# EAGLE design Dolgin_ATTinyV7 (EAGLE 9.4.2)
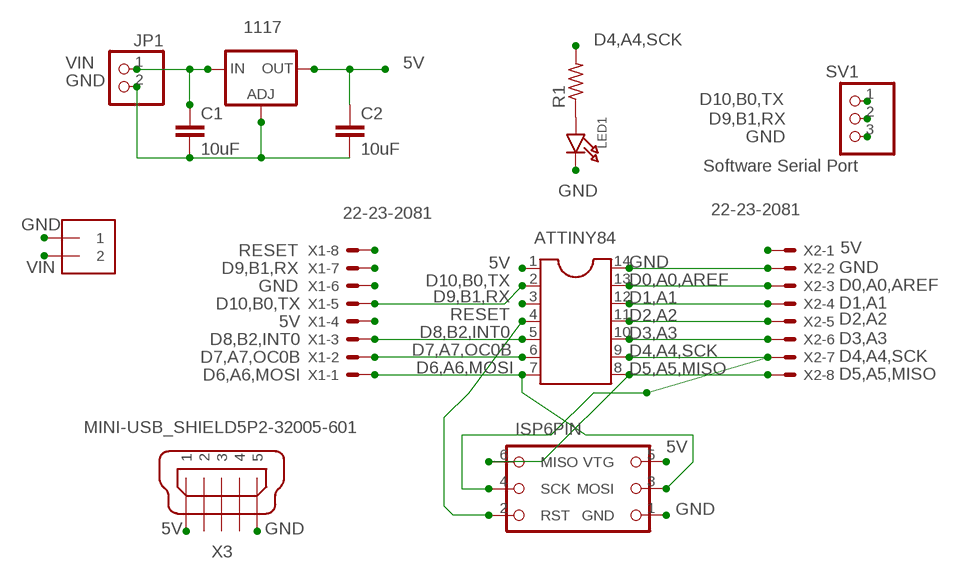
[diagram p0: schematic, sheet 1]

## Parts
1117  LM1117SOT223-REFLOW  [SOT223-R]
ATTINY84  DIL14  [DIL14]
C1  10uF  10UF-1206-6.3V-20%  [1206]
C2  10uF  10UF-1206-6.3V-20%  [1206]
H1  ISP_HEADER  [ICSP]
J1  1X2-3.5MM  [1X2-3.5MM]
JP1  PINHD-1X2  [1X02]
LED1  LED1206  [CHIPLED_1206]
R1  R-US_R1206  [R1206]
SV1  Software Serial Port  PINHD-1X3/90  [1X03/90]
X1  22-23-2081  [22-23-2081]
X2  22-23-2081  [22-23-2081]
X3  MINI-USB_SHIELD5P2-32005-601  [32005-601]

## Nets
5V: 1117.2(OUT) ATTINY84.1 C2.1 H1.5(VTG) X1.4 X2.1 X3.1
D0,A0,AREF: ATTINY84.13 X2.3
D1,A1: ATTINY84.12 X2.4
D2,A2: ATTINY84.11 X2.5
D3,A3: ATTINY84.10 X2.6
D4,A4,SCK: ATTINY84.9 H1.4(SCK) R1.2 X2.7
D5,A5,MISO: ATTINY84.8 H1.6(MISO) X2.8
D6,A6,MOSI: ATTINY84.7 H1.3(MOSI) X1.1
D7,A7,OC0B: ATTINY84.6 X1.2
D8,B2,INT0: ATTINY84.5 X1.3
D9,B1,RX: ATTINY84.3 SV1.2 X1.7
D10,B0,TX: ATTINY84.2 SV1.3 X1.5
GND: 1117.1(ADJ) ATTINY84.14 C1.2 C2.2 H1.1(GND) J1.1 JP1.2 LED1.C SV1.1 X1.6 X2.2 X3.5
N$1: LED1.A R1.1
RESET: ATTINY84.4 H1.2(RST) X1.8
VIN: 1117.3(IN) C1.1 J1.2 JP1.1
Unconnected: X3.2 X3.3 X3.4 X3.M1(S1) X3.M2(S2)

## Library data of the parts
1117 = microbuilder:LM1117: LM1117 Voltage Regulator LM1117 Adjustable Voltage regulator [Digikey: LM1117IMP-ADJDKR-ND] LM1117 3.3V Voltage regulator [AP1117E33GDIDKR-ND] LM1117 5.0V Voltage regulator [AP1117E50GDIDKR-ND] SOT223-REFLOW - SOT223 package for solder paste/reflow ovens SOT223-WAVE - SOT223 package for hand-soldering (larger pads) Note: For the fixed-voltage regulators, simply set the ADJ pin to GND.
ATTINY84 = ic-package:DIL14: Dual In Line / Socket
C1 C2 = SparkFun-Capacitors:10UF: 10.0µF ceramic capacitors A capacitor is a passive two-terminal electrical component used to store electrical energy temporarily in an electric field.; PROD_ID: CAP-10057
H1 = ACES_THT:ISP_HEADER: No more excuses for getting these lines crossed!
J1 = adafruit:1X2: 3.5mm Terminal block http://www.ladyada.net/library/pcb/eaglelibrary.html
JP1 = pinhead:PINHD-1X2: PIN HEADER
LED1 = microbuilder:LED: LED 0603 - 0603 Surface Mount Package 2mA: Green LED - Low Power (3.9mcd, 2ma, 1.7Vf) - Digikey: 475-2709-2-ND Orange LED - Low Power (9.8mcd, 2ma, 1.8Vf) - Digikey: 475-1194-2-ND Red LED - Low Power (5mcd, 2ma, 1.8Vf) - Digikey: 475-1195-2-ND Yellow LED - Low Power (7mcd, 2ma, 1.8Vf) - Digikey: 475-1196-2-ND 5mA: Blue LED - Low Power (17mcd, 5ma, 2.9Vf) - Digikey: LNJ937W8CRACT-ND 0805 - 0805 Surface Mount Package 2mA: Red LED (8.8mcd, 2mA, 1.8Vf, Clear) - Low Power [Digikey: 475-2510-1-ND] Green LED (5mcd, 2mA, 1.8Vf, Clear) - Low Power [Digikey: 475-2730-1-ND] Yellow LED (11.3mcd, 2mA, 1.8Vf, Clear) - Low Power [Digikey: 475-2555-1-ND] 20mA: Red LED (104mcd, 20mA, Diffused) - LS R976 [Digikey: 475-1278-6-ND] Red LED (12mcd, 20mA, 2.0Vf, Clear) - APT2012EC [Digikey: 754-1128-1-ND] Green LED (15mcd, 20mA, 2.2Vf, Clear) - APT2012GC [Digikey: 754-1131-1-ND] Orange LED (160mcd, 20mA, 2.1Vf, Clear) - APT2012SECK [Digikey: 754-1130-1-ND] 1206 - 1206 Surface Mount Package Green LED (26mcd, 20mA, Diffused) - LG N971 [Digikey: 475-1407-6-ND] Red LED (15mcd, 20mA, Diffused) - LH N974 [Digikey: 475-1416-6-ND]
R1 = resistor:R-US_: RESISTOR, American symbol
SV1 = pinhead:PINHD-1X3: PIN HEADER
X1 X2 = con-molex:22-23-2081: .100" (2.54mm) Center Header - 8 Pin; MF: MOLEX; MPN: 22-23-2081; OC_FARNELL: 1756826; OC_NEWARK: 01C7592
X3 = con-cypressindustries:MINI-USB_SHIELD5P2-: MINI USB-B R/A DIP 5pol. Source: www.cypressindustries.com; OC_FARNELL: unknown; OC_NEWARK: unknown

## Board
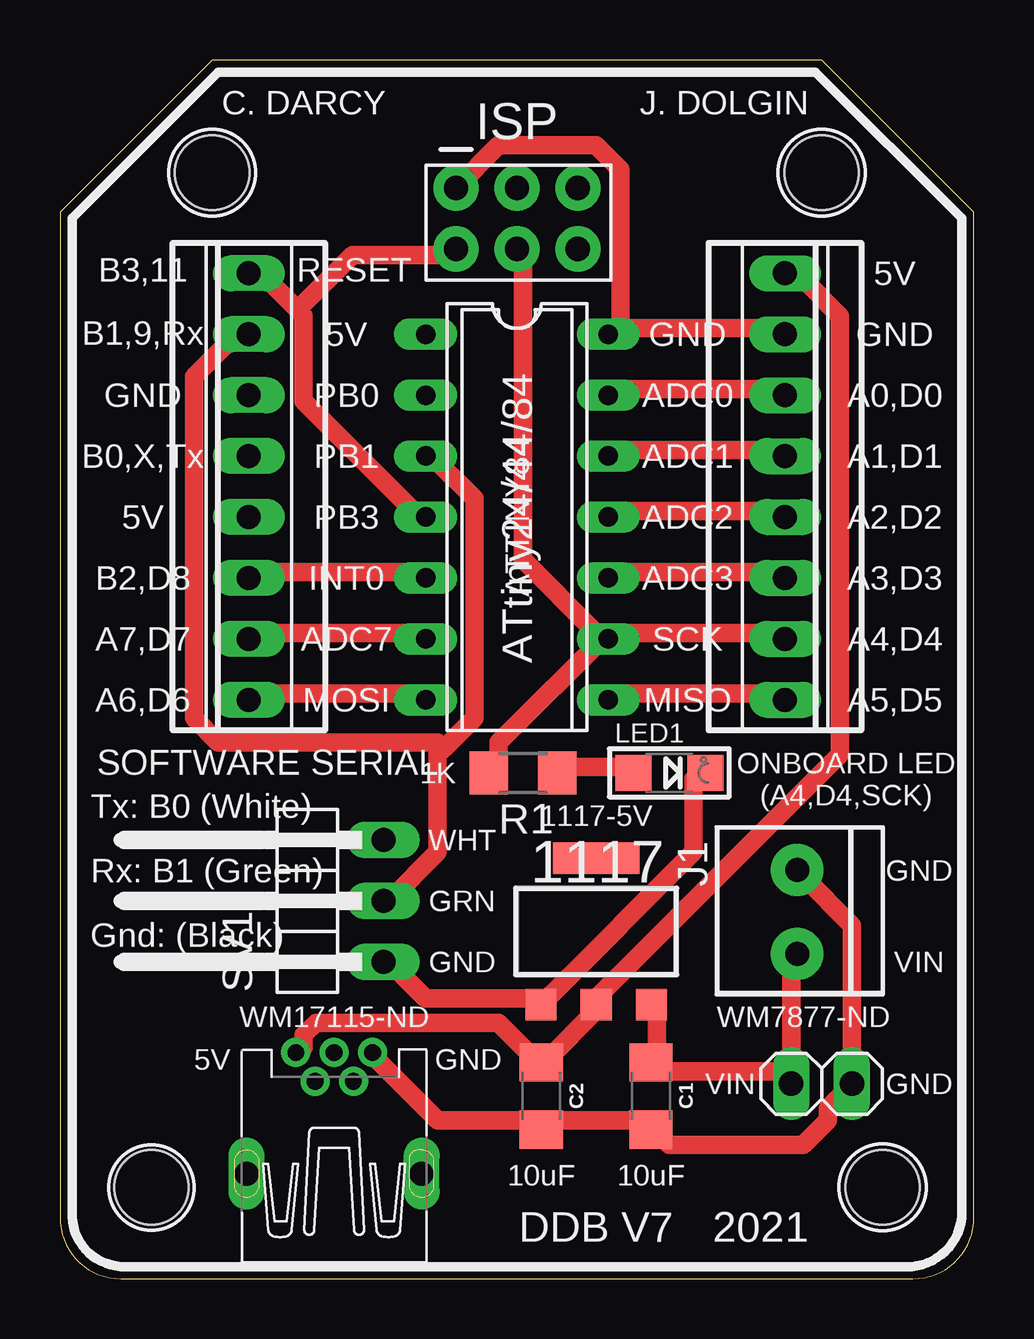
[diagram p1: board, top side]
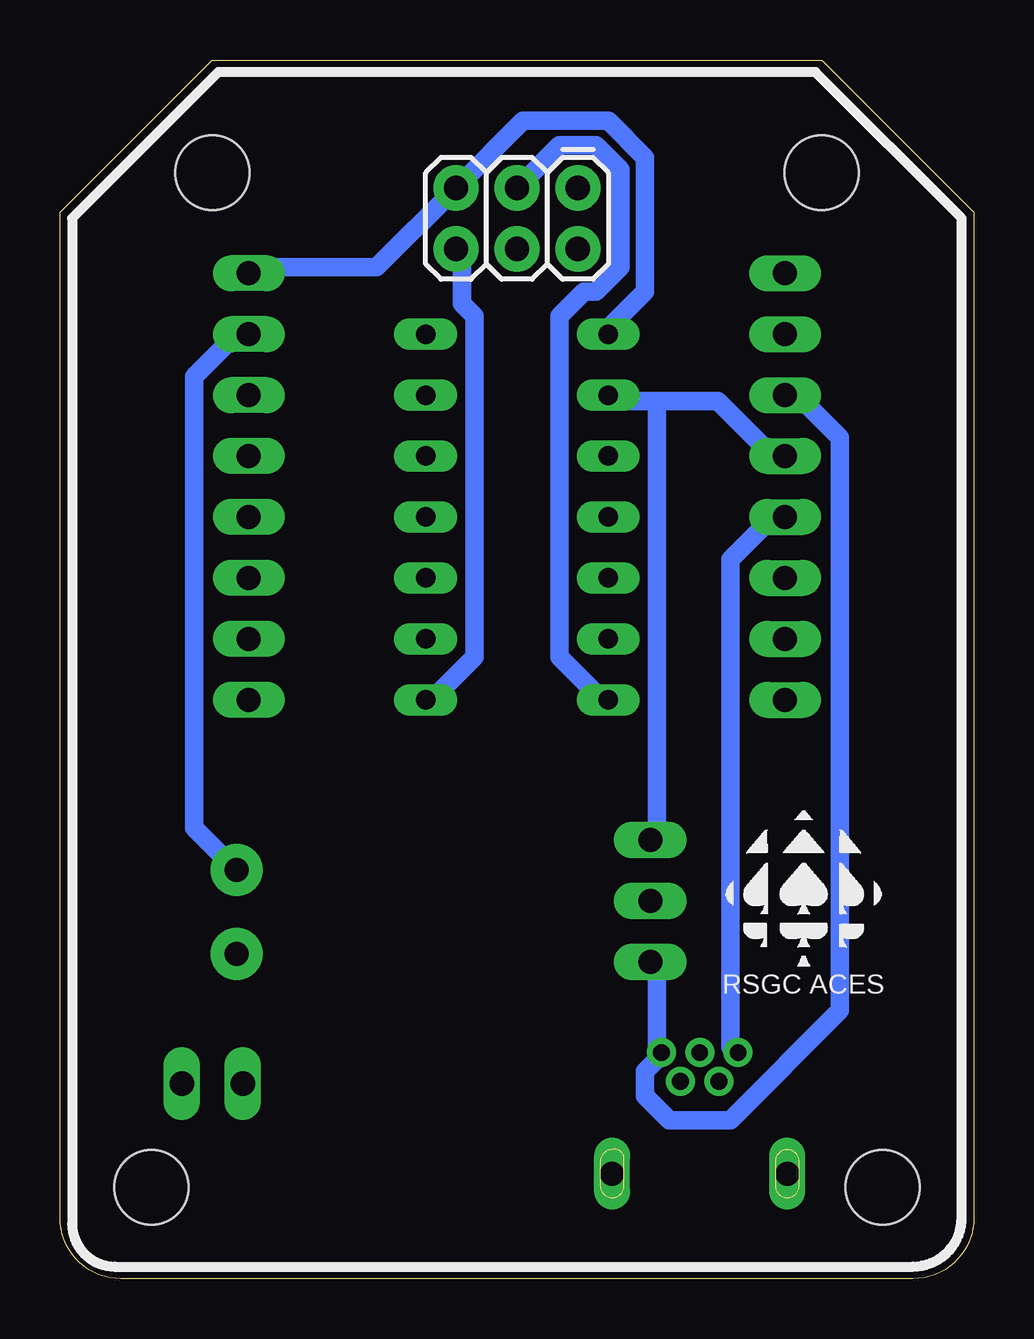
[diagram p2: board, bottom side, seen from below]

Size 38.1 x 50.8 mm. Coordinates in mm from the lower left corner, seen from the top.
Outline: 0,44.45 0,2.54 arc90 2.54,0 35.56,0 arc90 38.1,2.54 38.1,44.45 31.75,50.8 6.35,50.8 0,44.45
Copper layers (1*16): Top 0.035mm / dielectric 1.5mm / Bottom 0.035mm
Design rules "ACES_THT *": minimum track width 30mil, minimum drill 0.35mm, track to track 10mil, track to pad 10mil, pad to pad 10mil, via to via 10mil, smd to smd 6mil, copper to edge 40mil, drill to drill 6mil, minimum pad ring 10mil, minimum via ring 8mil, stop-mask expansion 4mil, vias tented up to drill 0mil, thermal gap 10mil
Holes 3.1 mm at 34.29,3.81 3.81,3.81 6.35,46.1 31.75,46.1

### Footprints (pad centres in the part's own frame; a part is rotated, then mirrored left to right if it is on the bottom)
SOT223-R = smd 1.3 x 1.3: 1 -2.3,-3.05; 2 0,-3.05; 3 2.3,-3.05 | smd 3.6 x 1.3: 4 0,3.05
DIL14 = drill 0.813 long: 1 -7.62,-3.81; 2 -5.08,-3.81; 3 -2.54,-3.81; 4 0,-3.81; 5 2.54,-3.81; 6 5.08,-3.81; 7 7.62,-3.81; 8 7.62,3.81; 9 5.08,3.81; 10 2.54,3.81; 11 0,3.81; 12 -2.54,3.81; 13 -5.08,3.81; 14 -7.62,3.81
1206 = smd 1.6 x 1.8: 1 -1.4,0; 2 1.4,0
ICSP = drill 1.016 pad 1.88: 1 0,0; 2 0,2.54; 3 2.54,0; 4 2.54,2.54; 5 5.08,0; 6 5.08,2.54
1X2-3.5MM = drill 1 pad 2.184: 1 1.8,0; 2 -1.7,0
1X02 = drill 1.016 long: 1 -1.27,0; 2 1.27,0
CHIPLED_1206 = smd 1.5 x 1.5: A 0,-1.496; C 0,1.496
R1206 = smd 1.6 x 1.803: 1 -1.422,0; 2 1.422,0
1X03/90 = drill 1.016 long: 1 -2.54,-3.81; 2 0,-3.81; 3 2.54,-3.81
22-23-2081 = drill 1 long: 1 -8.89,0; 2 -6.35,0; 3 -3.81,0; 4 -1.27,0; 5 1.27,0; 6 3.81,0; 7 6.35,0; 8 8.89,0
32005-601 = drill 0.7 pad 1.016: 1 2.825,1.6; 2 1.625,0.8; 3 2.825,0; 4 1.625,-0.8; 5 2.825,-1.6 | drill 1 pad 1.422 long: M1 -2.225,3.65; M2 -2.225,-3.65

### Placement (x,y rotation side)
1117  22.35,14.48 0 top
ATTINY84  19.05,31.75 270 top
C1  24.64,7.62 270 top
C2  20.07,7.62 270 top
H1  16.51,45.47 180 bottom
J1  30.73,15.24 90 top
JP1  31.75,8.13 0 top
LED1  25.4,21.08 270 top
R1  19.3,21.08 180 top
SV1  9.68,15.75 90 top
U$1  [ACES_LOGO_SMALL]  3.05,9.4 0 top
U$2  [ACES_LOGO_SMALL]  26.67,45.97 0 top
U$3  [MEDIUM_BSILK_TEXT]  7.11,16 0 top
U$4  [ACES_LOGO_SMALL]  11.68,45.97 0 top
X1  7.87,33.02 90 top
X2  30.23,33.02 270 top
X3  11.43,6.6 90 top

### Tracks (layer width: path | path; a pad name or v marks a point on that pad's centre or on a via)
5V
  Top 0.762: X3.1 10.16,9.65 10.16,10.16 10.67,10.67 18.29,10.67 19.81,9.14 C2.1 20.32,9.14 22.35,11.18 1117.2 22.35,11.68 32.51,21.84 32.51,40.13 30.99,41.66 30.48,41.66 X2.1
  Bottom 0.762: ATTINY84.1 15.24,39.62 13.72,41.15 13.72,46.74 15.24,48.26 18.8,48.26 H1.5 24.89,42.16 29.97,42.16 X2.1 | X1.4 8.13,31.5 8.64,31.5 10.16,29.97 10.16,9.65 X3.1
D0,A0,AREF
  Top 0.762: ATTINY84.13 22.86,37.08 29.97,37.08 X2.3
D1,A1
  Top 0.762: ATTINY84.12 22.86,34.54 29.97,34.54 X2.4
D2,A2
  Top 0.762: ATTINY84.11 22.86,32 29.97,32 X2.5
D3,A3
  Top 0.762: ATTINY84.10 22.86,29.46 29.97,29.46 X2.6
D4,A4,SCK
  Top 0.762: 22.86,26.92 18.29,22.35 18.29,21.34 R1.2 | 22.86,26.92 29.97,26.92 X2.7 | 22.86,26.92 ATTINY84.9 22.35,26.92 19.3,29.97 19.3,42.67 H1.4
D5,A5,MISO
  Top 0.762: ATTINY84.8 22.86,24.38 29.97,24.38 X2.8
  Bottom 0.762: H1.6 21.34,42.67 21.34,40.64 20.83,40.13 20.83,25.91 22.86,23.88 ATTINY84.8
D6,A6,MOSI
  Top 0.762: ATTINY84.7 15.24,24.38 8.13,24.38 X1.1
  Bottom 0.762: H1.3 17.27,47.24 15.75,47.24 14.73,46.23 14.73,42.16 15.75,41.15 16.26,41.15 17.27,40.13 17.27,25.91 15.24,23.88 ATTINY84.7
D7,A7,OC0B
  Top 0.762: ATTINY84.6 15.24,26.92 8.13,26.92 X1.2
D8,B2,INT0
  Top 0.762: ATTINY84.5 15.24,29.46 8.13,29.46 X1.3
D9,B1,RX
  Top 0.762: 16,22.1 15.75,21.84 15.75,17.78 13.72,15.75 SV1.2 | 16,22.1 17.27,23.37 17.27,32.51 15.75,34.04 15.24,34.04 ATTINY84.3 | X1.7 7.62,39.12 7.11,39.12 5.59,37.59 5.59,23.37 6.6,22.35 15.75,22.35 16,22.1
D10,B0,TX
  Bottom 0.762: 13.21,36.58 10.67,36.58 8.13,34.04 X1.5 | 13.21,36.58 15.24,36.58 ATTINY84.2 | 13.21,36.58 13.21,18.29 SV1.3
GND
  Top 0.762: 23.37,39.62 29.97,39.62 X2.2 | 23.37,39.62 22.86,39.62 ATTINY84.14 23.37,39.62 | H1.1 18.29,47.24 22.35,47.24 23.37,46.23 23.37,39.62 | J1.1 30.99,16.76 33.02,14.73 JP1.2 32,7.11 32,6.6 30.99,5.59 25.4,5.59 24.89,6.1 C1.2 24.38,6.6 20.32,6.6 C2.2 19.81,6.6 15.75,6.6 13.21,9.14 X3.5 | SV1.1 13.72,13.21 15.24,11.68 19.81,11.68 1117.1 20.32,11.68 26.42,17.78 26.42,20.83 LED1.C
  Bottom 0.762: SV1.1 13.21,13.21 13.21,9.65 X3.5 13.21,9.14 13.72,8.64 13.72,7.62 12.7,6.6 10.16,6.6 5.59,11.18 5.59,35.05 7.11,36.58 7.62,36.58 X1.6 | X2.2 30.48,39.12 30.99,39.12 32.51,37.59 32.51,18.8 30.99,17.27 J1.1
N$1
  Top 0.762: LED1.A 23.88,21.34 20.83,21.34 R1.1
RESET
  Top 0.762: 9.91,40.39 8.13,42.16 X1.8 | 9.91,40.39 10.16,40.13 10.16,36.58 14.73,32 15.24,32 ATTINY84.4 | 9.91,40.39 12.19,42.67 16.26,42.67 H1.2
VIN
  Top 0.762: 1117.3 24.89,11.18 24.89,9.14 C1.1 24.89,8.64 29.97,8.64 JP1.1 30.48,13.21 J1.2

### Text on the board
_tsilk: C. DARCY | J. DOLGIN | ISP | B3,11 | RESET | 5V | B1,9,Rx | 5V | GND | GND | GND | PB0 | ADC0 | A0,D0 | B0,X,Tx | PB1 | ADC1 | A1,D1 | 5V | PB3 | ATtiny24/44/84 | ADC2 | A2,D2 | B2,D8 | INT0 | ADC3 | A3,D3 | A7,D7 | ADC7 | SCK | A4,D4 | A6,D6 | MOSI | MISO | A5,D5 | SOFTWARE SERIAL | 1K | ONBOARD LED / (A4,D4,SCK) | 1117-5V | WHT | Tx: B0 (White) / / Rx: B1 (Green) / / Gnd: (Black) | GND | GRN | GND | VIN | WM17115-ND | WM7877-ND | 5V | GND | VIN | GND | 10uF | 10uF | DDB V7 | 2021